# Altium schematic sheet SD-TF.SchDoc
size A
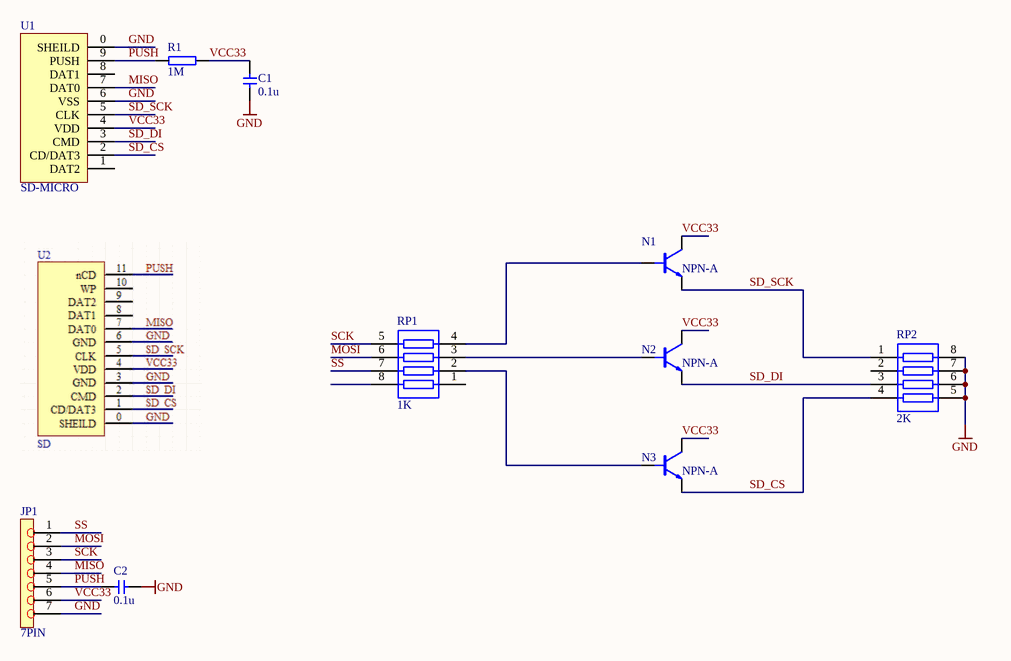
[diagram p0: SD-TF.SchDoc]

## Parts
C1  0.1u  [RC100]
C2  0.1u  [0805]
JP1  7PIN  [SIP7]
N1  NPN-A  [SOT-23A]
N2  NPN-A  [SOT-23A]
N3  NPN-A  [SOT-23A]
R1  1M  [0805]
RP1  1K  [RN4]
RP2  2K  [RN4]
U1  SD-MICRO  [TF-2]

## Nets
GND: C1.2 C2.2 JP1.7 RP2.5 RP2.6 RP2.7 RP2.8 U1.0(SHEILD) U1.6(VSS)
MISO: JP1.4 U1.7(DAT0)
MOSI: JP1.2 RP1.6
PUSH: C2.1 JP1.5 R1.2 U1.9(PUSH)
SCK: JP1.3 RP1.5
SD_CS: N3.E RP2.4 U1.2(CD/DAT3)
SD_DI: N2.E RP2.3 U1.3(CMD)
SD_SCK: N1.E RP2.1 U1.5(CLK)
SS: JP1.1 RP1.7
VCC33: C1.1 JP1.6 N1.C N2.C N3.C R1.1 U1.4(VDD)
NetN1_B: N1.B RP1.4
NetN2_B: N2.B RP1.3
NetN3_B: N3.B RP1.2

Not connected (* = marked no-connect by the designer): RP1 1 8; RP2 2; U1 1(DAT2) 8(DAT1)

## Library data of the parts
C1 C2 = CAPA
R1 = RES2A
RP1 RP2 = RESPACK4